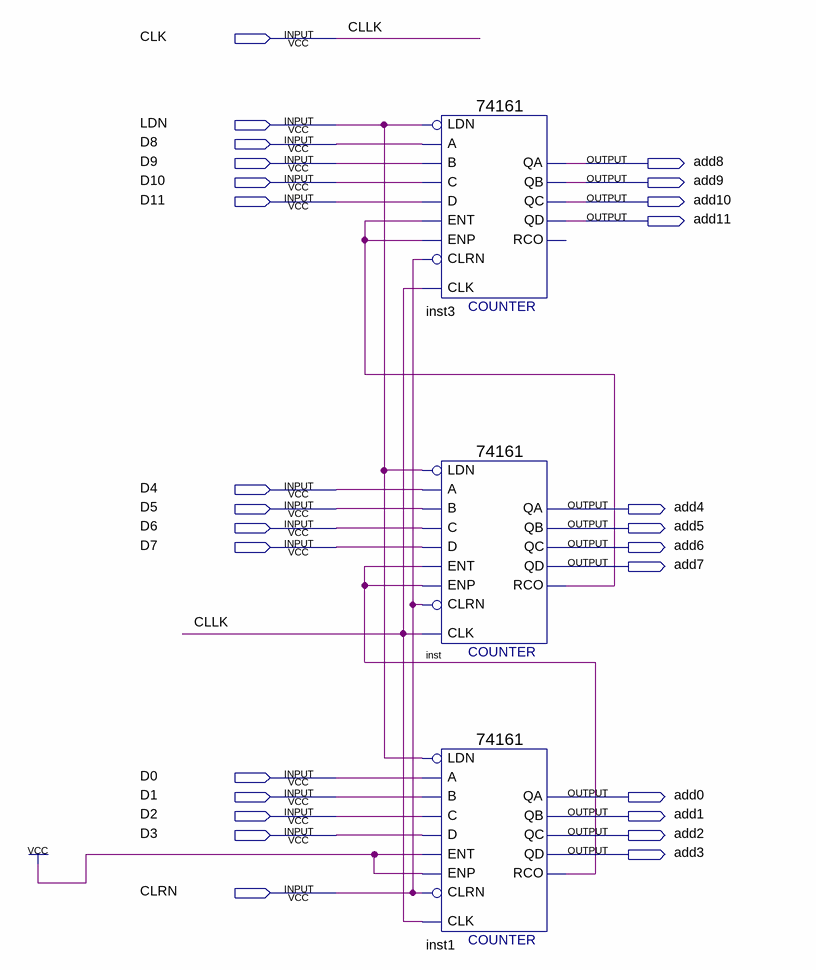
[diagram p0: schematic sheet]
// Quartus schematic uPC.bdf as structural Verilog: 3 symbols, 27 pins
module uPC (
  input  CLK,
  input  LDN,
  input  D8,
  input  D9,
  input  D10,
  input  D11,
  input  D4,
  input  D5,
  input  D6,
  input  D7,
  input  D0,
  input  D1,
  input  D2,
  input  D3,
  input  CLRN,
  output add8,
  output add9,
  output add10,
  output add11,
  output add4,
  output add5,
  output add6,
  output add7,
  output add0,
  output add1,
  output add2,
  output add3
);

  wire inst1_rco, inst_rco;

  \74161  inst3 (
    .CLRN(CLRN), .CLK(CLK), .ENP(inst_rco), .LDN(LDN), .A(D8), .D(D11), .ENT(inst_rco), .B(D9), .C(D10),
    .QD(add11), .QC(add10), .QB(add9), .QA(add8));  // open: RCO
  \74161  inst (
    .CLRN(CLRN), .CLK(CLK), .ENP(inst1_rco), .LDN(LDN), .A(D4), .D(D7), .ENT(inst1_rco), .B(D5), .C(D6),
    .QD(add7), .QC(add6), .QB(add5), .QA(add4), .RCO(inst_rco));
  \74161  inst1 (
    .CLRN(CLRN), .CLK(CLK), .ENP(1'b1), .LDN(LDN), .A(D0), .D(D3), .ENT(1'b1), .B(D1), .C(D2), .QD(add3),
    .QC(add2), .QB(add1), .QA(add0), .RCO(inst1_rco));

  // Other names for the same wires on the sheet: CLLK = CLK
endmodule
